# Altium schematic sheet Connectors.SchDoc
size A3; SheetNumber: 3; SheetTotal: 4
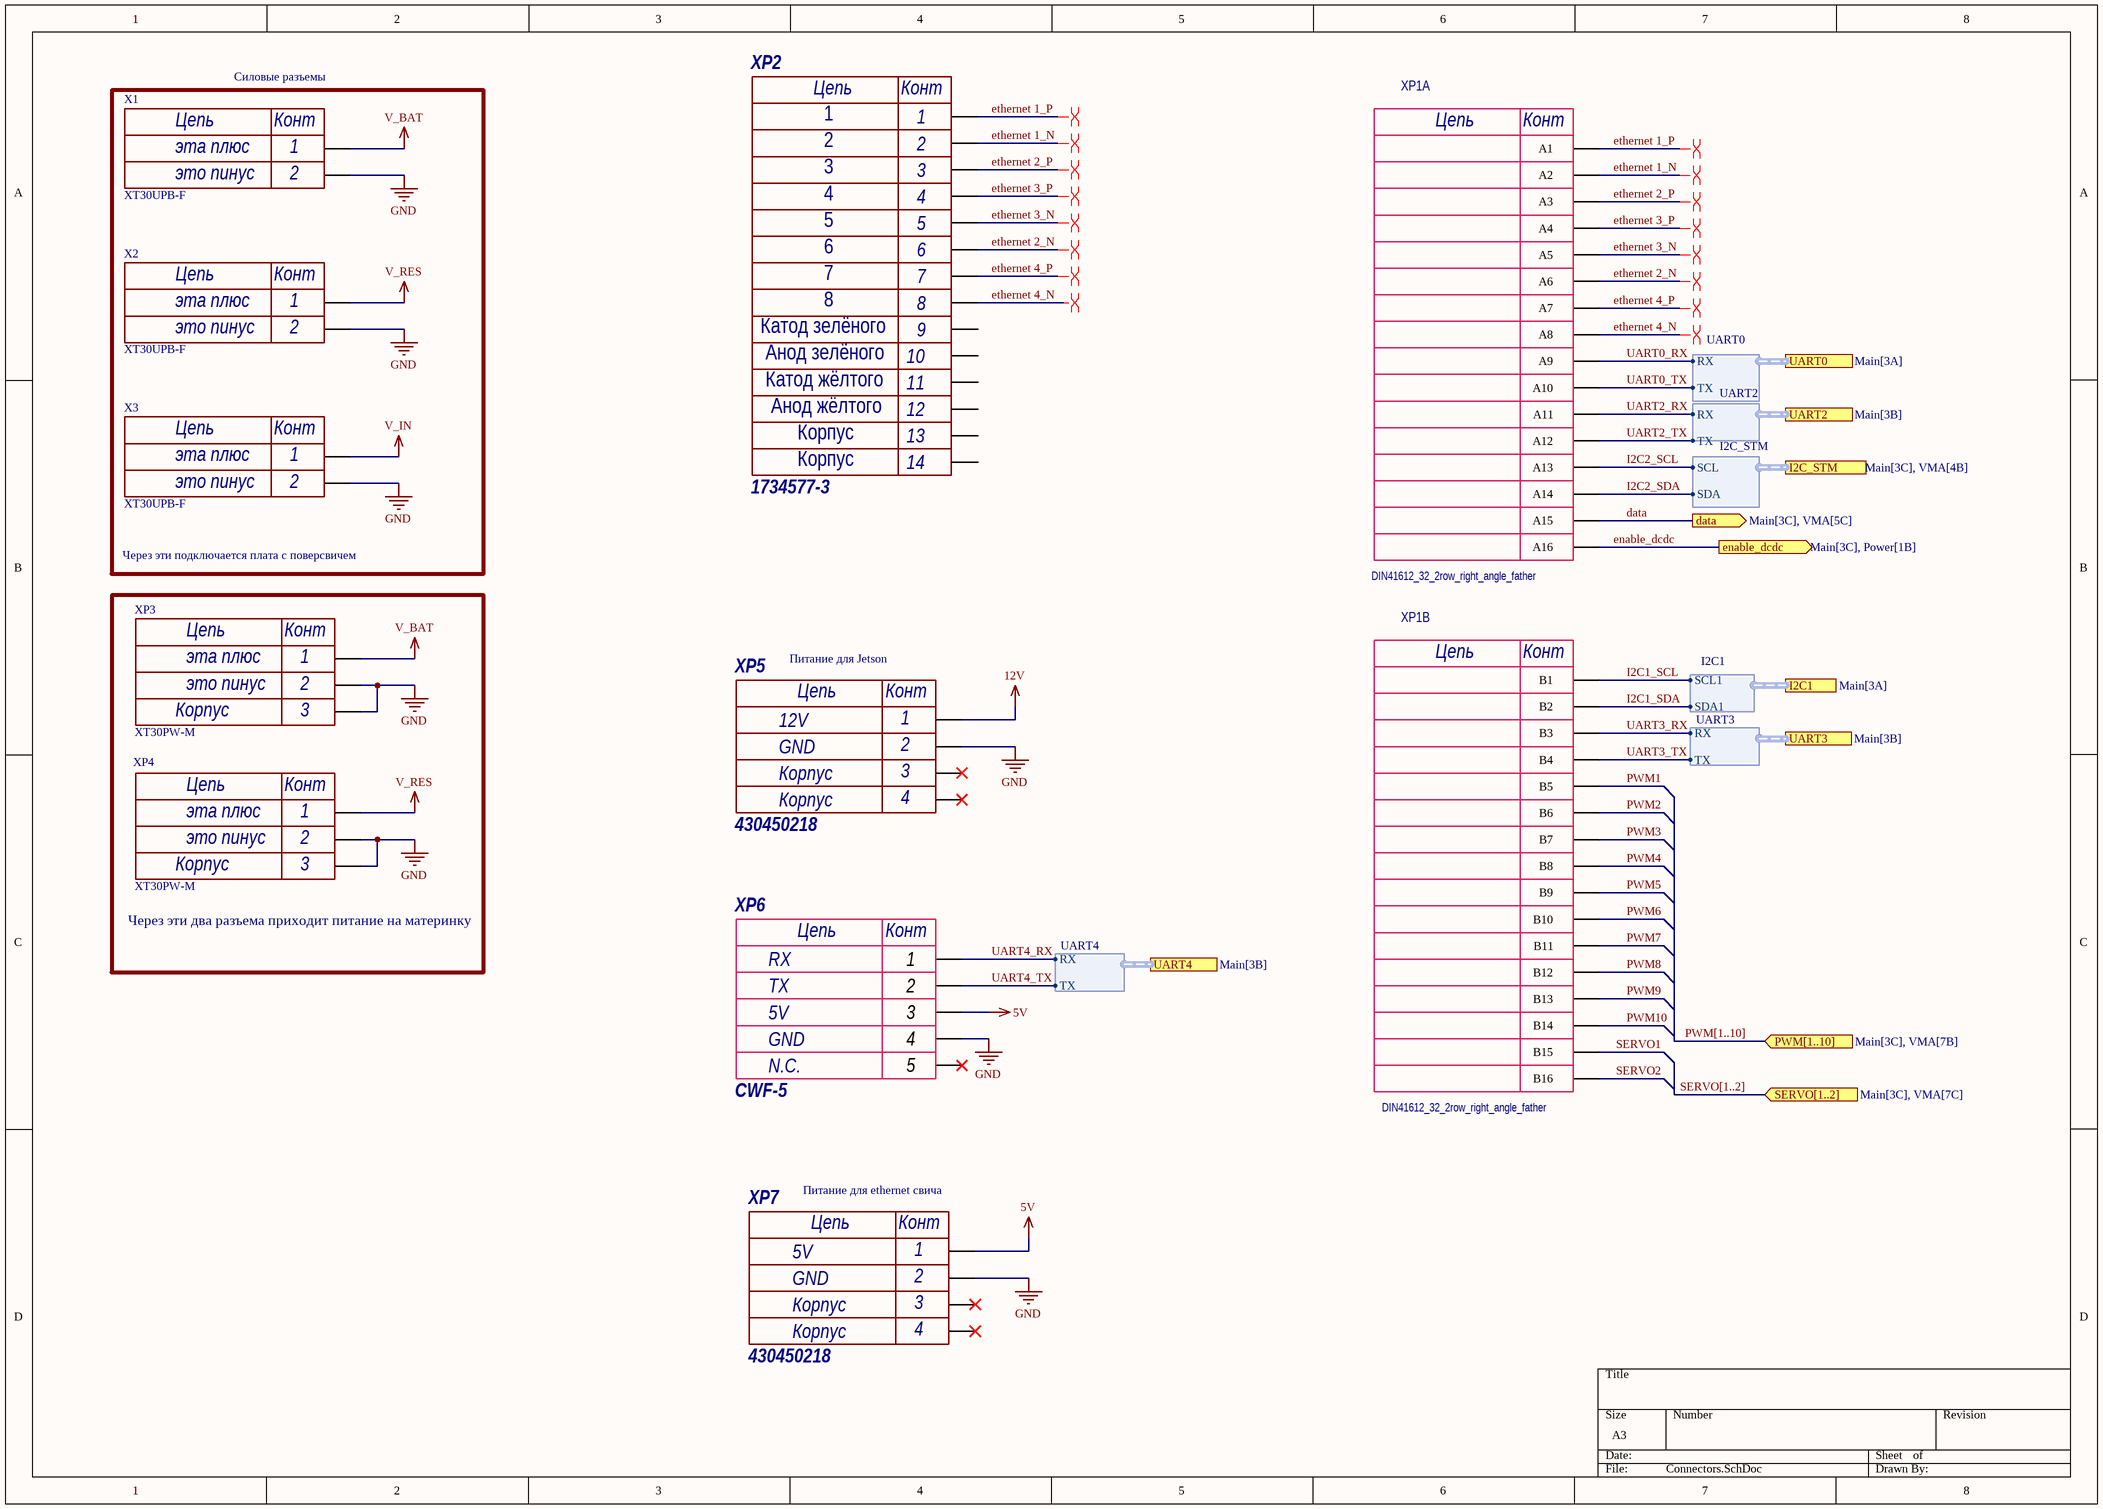
[diagram p0: Connectors.SchDoc]

## Parts
X1  XT30UPB-F  Value2: это пинус  Value1: эта плюс  [XT30UPB-F]
X2  XT30UPB-F  Value2: это пинус  Value1: эта плюс  [XT30UPB-F]
X3  XT30UPB-F  Value2: это пинус  Value1: эта плюс  [XT30UPB-F]
XP1  DIN41612_32_2row_right_angle_father  [DIN41612_32_2row_right_angle_father]  (parts A,B of 2)
XP2  1734577-3  [1-1734577-3-rj45-8p8c]
XP3  XT30PW-M  Value3: Корпус  Value2: это пинус  Value1: эта плюс  [XT30PW-M]
XP4  XT30PW-M  Value3: Корпус  Value2: это пинус  Value1: эта плюс  [XT30PW-M]
XP5  430450218  Value3: Корпус  Value2: GND  Value1: 12V  Parameter 1: Питание для Jetson  [Molex_430450218]
XP6  CWF-5  Value1: RX  Value2: TX  Value3: 5V  Value4: GND  Value5: N.C.  [CWF-5]
XP7  430450218  Value3: Корпус  Value2: GND  Value1: 5V  Parameter 1: Питание для ethernet свича  [Molex_430450218]

## Blocks framed on the sheet
Через эти два разъема приходит питание на материнку: XP3 XP4

## Ports
data (out, see Main[3C], VMA[5C]), enable_dcdc (out, see Main[3C], Power[1B]), I2C1 (harness I2C1, see Main[3A]), I2C_STM (harness I2C_STM, see Main[3C], VMA[4B]), PWM[1..10] (in, see Main[3C], VMA[7B]), SERVO[1..2] (in, see Main[3C], VMA[7C]), UART0 (harness UART0, see Main[3A]), UART2 (harness UART2, see Main[3B]), UART3 (harness UART3, see Main[3B]), UART4 (harness UART4, see Main[3B])

## Harnesses
I2C1: SDA1, SCL1
UART3: RX, TX
UART0: RX, TX
UART2: RX, TX
I2C_STM: SDA, SCL
UART4: RX, TX

## Nets
5V: XP6.3 XP7.1
12V: XP5.1
GND: X1.N X2.N X3.N XP3.0 XP3.N XP4.0 XP4.N XP5.2 XP6.4 XP7.2
V_BAT: X1.P XP3.P
V_IN: X3.P
V_RES: X2.P XP4.P
data: XP1.A15 ; port data
enable_dcdc: XP1.A16 ; port enable_dcdc
ethernet 1_N: XP1.A2 XP2.2
ethernet 1_P: XP1.A1 XP2.1
ethernet 2_N: XP1.A6 XP2.6
ethernet 2_P: XP1.A3 XP2.3
ethernet 3_N: XP1.A5 XP2.5
ethernet 3_P: XP1.A4 XP2.4
ethernet 4_N: XP1.A8 XP2.8
ethernet 4_P: XP1.A7 XP2.7
I2C1_SCL: XP1.B1 ; port I2C1.SCL1
I2C1_SDA: XP1.B2 ; port I2C1.SDA1
I2C2_SCL: XP1.A13 ; port I2C_STM.SCL
I2C2_SDA: XP1.A14 ; port I2C_STM.SDA
PWM1: XP1.B5
PWM2: XP1.B6
PWM3: XP1.B7
PWM4: XP1.B8
PWM5: XP1.B9
PWM6: XP1.B10
PWM7: XP1.B11
PWM8: XP1.B12
PWM9: XP1.B13
PWM10: XP1.B14
SERVO1: XP1.B15
SERVO2: XP1.B16
UART0_RX: XP1.A9 ; port UART0.RX
UART0_TX: XP1.A10 ; port UART0.TX
UART2_RX: XP1.A11 ; port UART2.RX
UART2_TX: XP1.A12 ; port UART2.TX
UART3_RX: XP1.B3 ; port UART3.RX
UART3_TX: XP1.B4 ; port UART3.TX
UART4_RX: XP6.1 ; port UART4.RX
UART4_TX: XP6.2 ; port UART4.TX

Not connected (* = marked no-connect by the designer): XP2 9 10 11 12 MH1 MH2; XP5 0*; XP6 5*; XP7 0*

## Buses and harness runs
bus PWM[1..10] = port PWM[1..10]
bus SERVO[1..2] = port SERVO[1..2]

## Layout directives
differential pair: ethernet 1_N, ethernet 1_P, ethernet 2_N, ethernet 2_P, ethernet 3_N, ethernet 3_P, ethernet 4_N, ethernet 4_P

## Notes on the sheet
- Силовые разъемы
- Через эти подключается плата с поверсвичем
- (in symbol 1-1734577-3-rj45-8p8c) Цепь; Конт; Катод зелёного; Анод зелёного; Катод жёлтого; Анод жёлтого; Корпус; 13; 14
- (in symbol CWF-5) Цепь; Конт
- (in symbol DIN41612_32_2row_right_angle_father, part A) Цепь; Конт
- (in symbol DIN41612_32_2row_right_angle_father, part B) Цепь; Конт
- (in symbol Molex_430450218) Цепь; Конт; 3; 4
- (in symbol XT30PW-M) Цепь; Конт; 1; 2; 3
- (in symbol XT30UPB-F) Цепь; Конт; 1; 2

## Library data of the parts
X1-X3 = XT30UPB-F: 30 А (15 продолжительно), прямая мать; Part Number: XT30UPB-F
XP1 = DIN41612_32_2row_right_angle_father: DIN41612R (DS1118-32M0R23), Разъем (вилка) тип B 32pin (2х16), шаг 2.54мм двухрядный угловой (ряд АВ); System: Connector; Part Number: DIN41612_32_2row_right_angle_father
XP2 = 1-1734577-3-rj45-8p8c: Модульный разъем, Cat3, RJ45, Гнездо, 8 контакт(-ов), 8 вывод(-ов), 1 порт(-ов); Part Number: 1-1734577-3-rj45-8p8c
XP3 XP4 = XT30PW-M: 30 А (15 продолжительно), 2 контакта разъем угловой отец; System: Connector; Part Number: XT30PW-M
XP5 XP7 = Molex_430450218: Разъем типа провод-плата, 3 мм, 2 контакт(-ов), Штыревой Разъем, Серия Micro-Fit для поверхностного монтажа; Value4: Корпус; Part Number: Molex_430450218
XP6 = CWF-5: 5-пиновый разъем с ключом; Part Number: CWF-5